# EAGLE schematic additionneur (EAGLE 7.6.0)
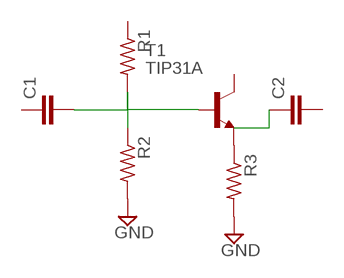
[diagram p0: schematic, sheet 1]

## Parts
C1  C-EUC0603  [C0603]
C2  C-EUC0603  [C0603]
R1  R-US_R0603  [R0603]
R2  R-US_R0603  [R0603]
R3  R-US_R0603  [R0603]
T1  TIP31A  [TO220]

## Nets
GND: R2.2 R3.2
N$1: R3.1 T1.3(E)
N$2: C1.2 R1.2 R2.1 T1.1(B)
N$3: C2.1
Unconnected: C1.1 C2.2 R1.1 T1.2(C)

## Library data of the parts
C1 C2 = rcl:C-EU: CAPACITOR, European symbol
R1-R3 = resistor:R-US_: RESISTOR, American symbol
T1 = transistor:TIP31: NPN Transistor Medium Power Linear Switching Applications Source: http://onsemi.com